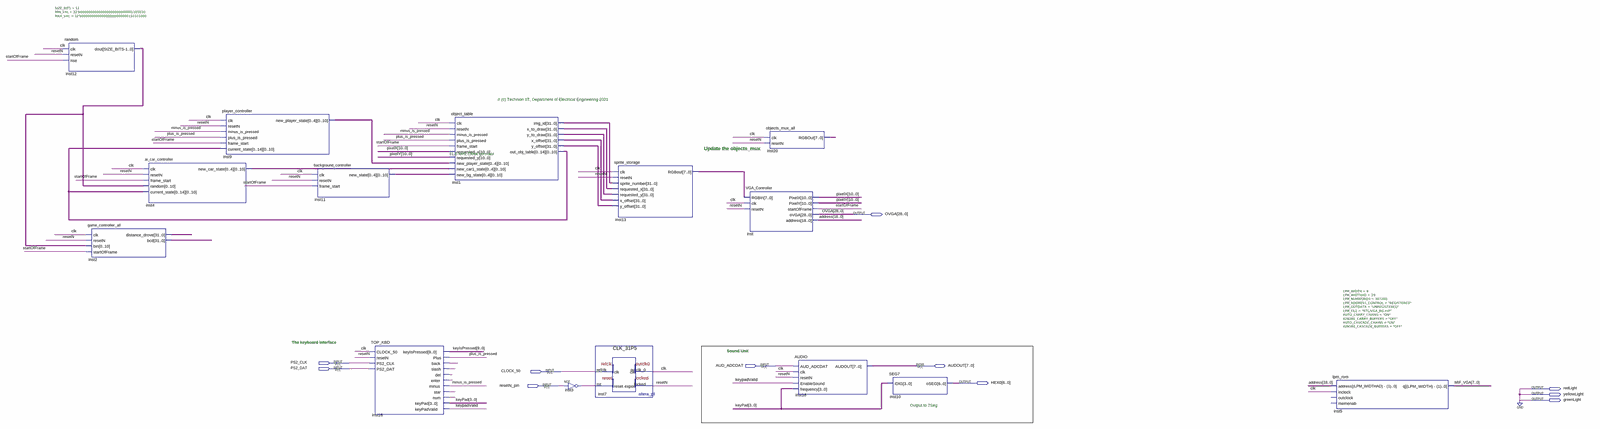
[diagram p0: schematic sheet, whole]
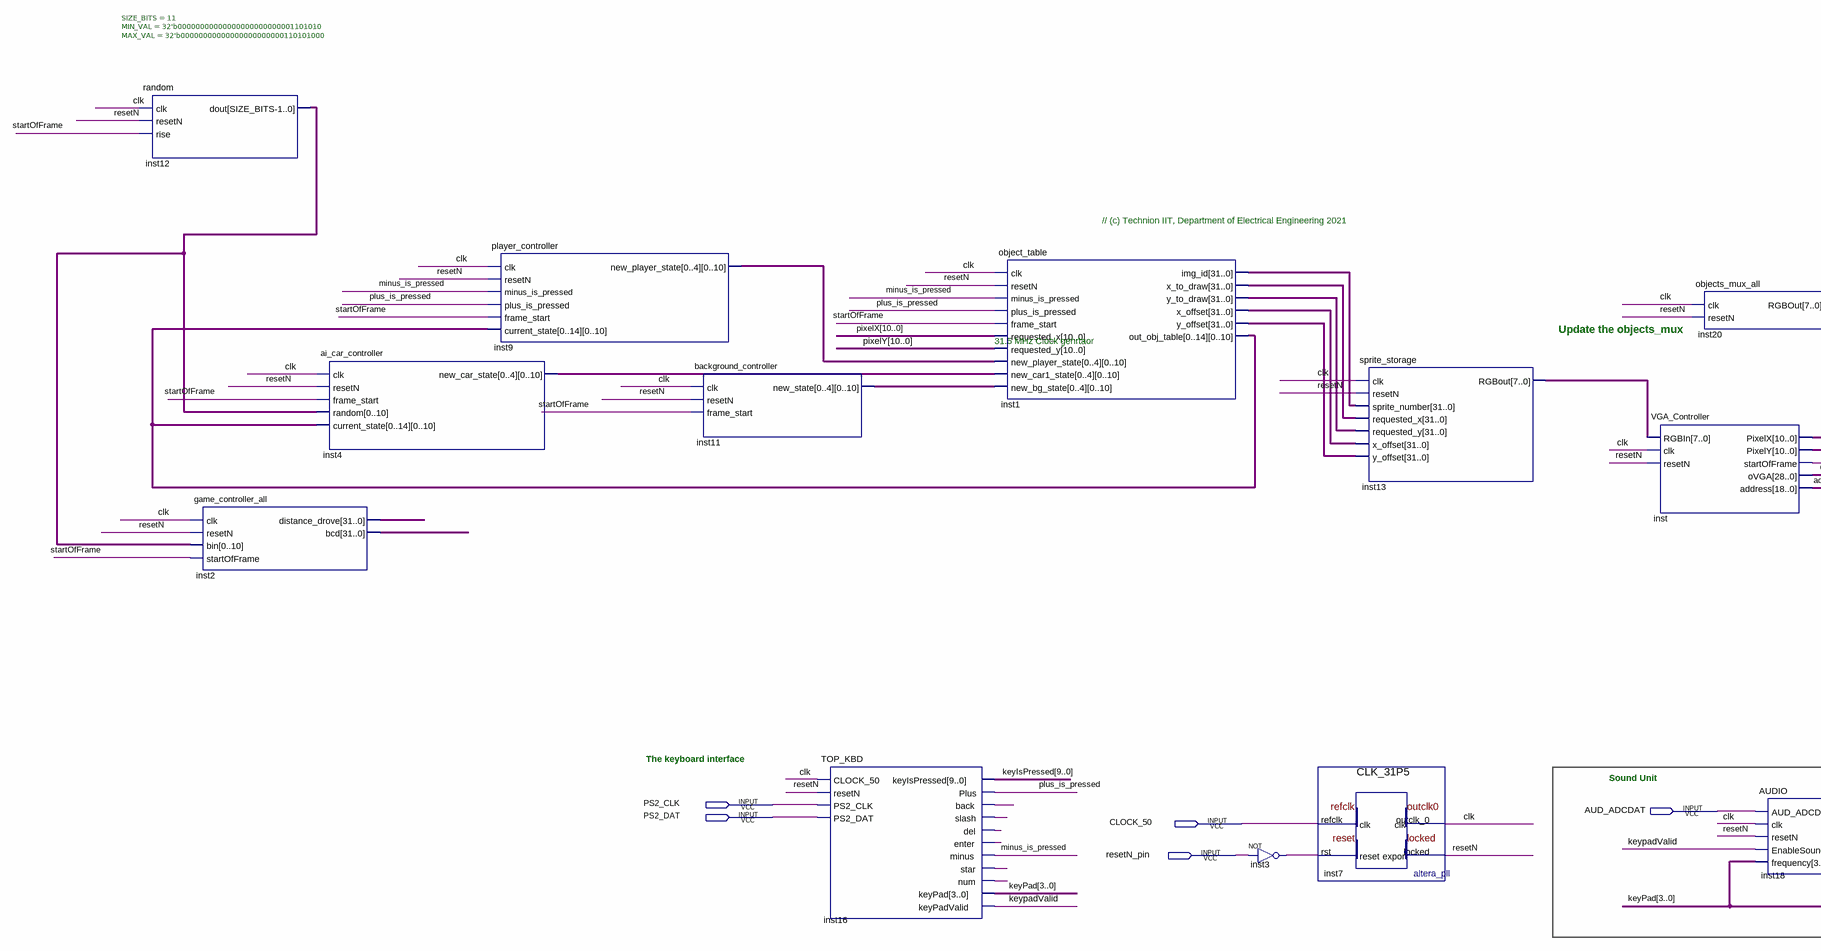
[diagram p1: schematic sheet, left part]
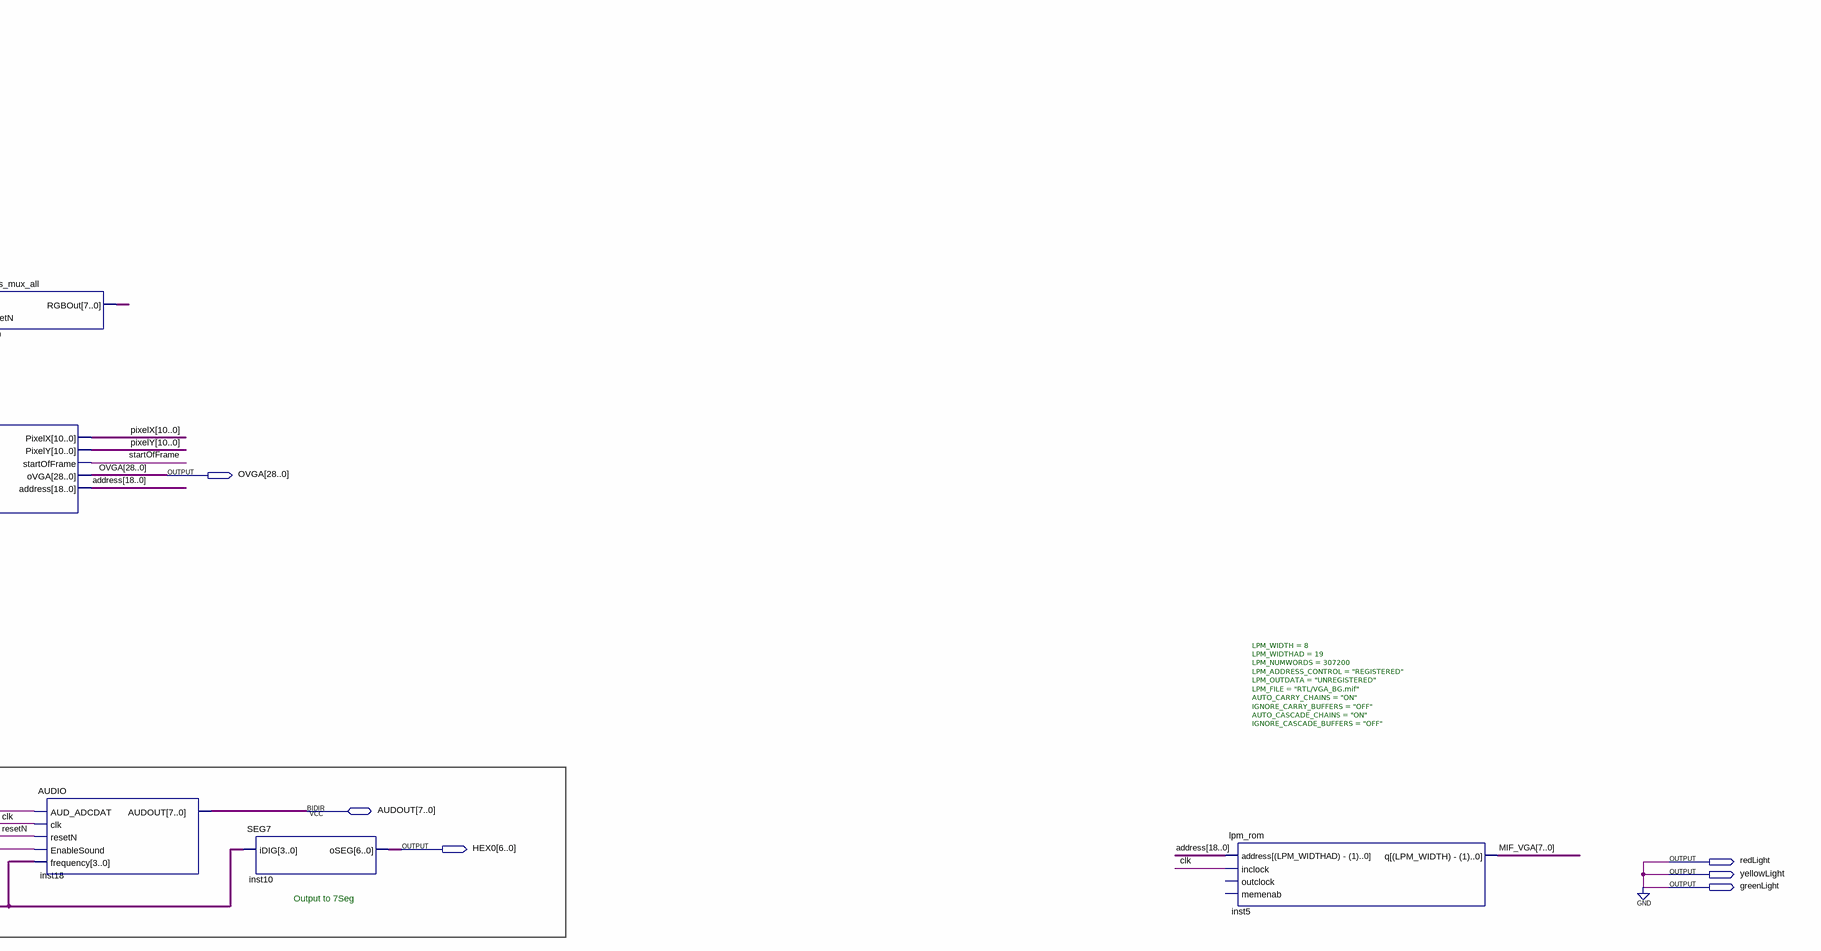
[diagram p2: schematic sheet, right part]
// Quartus schematic TOP_VGA_DEMO_KBD_MOVING_HARTS.bdf as structural Verilog: 15 symbols, 11 pins
module TOP_VGA_DEMO_KBD_MOVING_HARTS (
  input  PS2_CLK,
  input  AUD_ADCDAT,
  input  PS2_DAT,
  input  CLOCK_50,
  input  resetN_pin,
  inout  [7:0] AUDOUT,
  output [28:0] OVGA,
  output [6:0] HEX0,
  output redLight,
  output yellowLight,
  output greenLight
);

  wire clk, inst3_out, inst16_back, inst16_del, inst16_enter, inst16_num, inst16_slash, inst16_star,
       keypadValid, minus_is_pressed, plus_is_pressed, resetN, startOfFrame;
  wire [3:0] keyPad;
  wire [7:0] inst13_rgbout, inst20_rgbout, MIF_VGA;
  wire [9:0] keyIsPressed;
  wire [10:0] inst12_dout, pixelX, pixelY;
  wire [18:0] address;
  wire [31:0] inst1_img_id, inst1_x_offset, inst1_x_to_draw, inst1_y_offset, inst1_y_to_draw, inst2_bcd,
       inst2_distance_drove;
  wire [54:0] inst4_new_car_state, inst9_new_player_state, inst11_new_state;
  wire [164:0] inst1_out_obj_table;

  random #(.SIZE_BITS(11), .MIN_VAL(32'b00000000000000000000000001101010), .MAX_VAL(32'b00000000000000000000000110101000)) inst12 (
    .clk(clk), .resetN(resetN), .rise(startOfFrame), .dout(inst12_dout));
  game_controller_all inst2 (
    .clk(clk), .resetN(resetN), .bin(inst12_dout), .startOfFrame(startOfFrame),
    .distance_drove(inst2_distance_drove), .bcd(inst2_bcd));
  ai_car_controller inst4 (
    .clk(clk), .resetN(resetN), .frame_start(startOfFrame), .random(inst12_dout),
    .current_state(inst1_out_obj_table), .new_car_state(inst4_new_car_state));
  player_controller inst9 (
    .clk(clk), .resetN(resetN), .minus_is_pressed(minus_is_pressed), .plus_is_pressed(plus_is_pressed),
    .frame_start(startOfFrame), .current_state(inst1_out_obj_table), .new_player_state(inst9_new_player_state));
  background_controller inst11 (.clk(clk), .resetN(resetN), .frame_start(startOfFrame), .new_state(inst11_new_state));
  TOP_KBD inst16 (
    .CLOCK_50(clk), .resetN(resetN), .PS2_CLK(PS2_CLK), .PS2_DAT(PS2_DAT), .keyIsPressed(keyIsPressed),
    .Plus(plus_is_pressed), .back(inst16_back), .slash(inst16_slash), .del(inst16_del), .enter(inst16_enter),
    .minus(minus_is_pressed), .star(inst16_star), .num(inst16_num), .keyPad(keyPad), .keyPadValid(keypadValid));
  object_table inst1 (
    .clk(clk), .resetN(resetN), .minus_is_pressed(minus_is_pressed), .plus_is_pressed(plus_is_pressed),
    .frame_start(startOfFrame), .requested_x(pixelX), .requested_y(pixelY),
    .new_player_state(inst9_new_player_state), .new_car1_state(inst4_new_car_state),
    .new_bg_state(inst11_new_state), .img_id(inst1_img_id), .x_to_draw(inst1_x_to_draw),
    .y_to_draw(inst1_y_to_draw), .x_offset(inst1_x_offset), .y_offset(inst1_y_offset),
    .out_obj_table(inst1_out_obj_table));
  not inst3 (inst3_out, resetN_pin);
  CLK_31P5 inst7 (.refclk(CLOCK_50), .rst(inst3_out), .outclk_0(clk), .locked(resetN));
  sprite_storage inst13 (
    .clk(clk), .resetN(resetN), .sprite_number(inst1_img_id), .requested_x(inst1_x_to_draw),
    .requested_y(inst1_y_to_draw), .x_offset(inst1_x_offset), .y_offset(inst1_y_offset),
    .RGBout(inst13_rgbout));
  objects_mux_all inst20 (.clk(clk), .resetN(resetN), .RGBOut(inst20_rgbout));
  VGA_Controller inst (
    .RGBIn(inst13_rgbout), .clk(clk), .resetN(resetN), .PixelX(pixelX), .PixelY(pixelY),
    .startOfFrame(startOfFrame), .oVGA(OVGA), .address(address));
  AUDIO inst18 (
    .AUD_ADCDAT(AUD_ADCDAT), .clk(clk), .resetN(resetN), .EnableSound(keypadValid), .frequency(keyPad),
    .AUDOUT(AUDOUT));
  SEG7 inst10 (.iDIG(keyPad), .oSEG(HEX0));
  lpm_rom #(.LPM_WIDTH(8), .LPM_WIDTHAD(19), .LPM_NUMWORDS(307200), .LPM_ADDRESS_CONTROL("REGISTERED"), .LPM_OUTDATA("UNREGISTERED"), .LPM_FILE("RTL/VGA_BG.mif"), .AUTO_CARRY_CHAINS("ON"), .IGNORE_CARRY_BUFFERS("OFF"), .AUTO_CASCADE_CHAINS("ON"), .IGNORE_CASCADE_BUFFERS("OFF")) inst5 (
    .address(address), .inclock(clk), .q(MIF_VGA));  // open: outclock, memenab

  assign greenLight = 1'b0;
  assign redLight = 1'b0;
  assign yellowLight = 1'b0;

  // Notes on the sheet:
  //   // (c) Technion IIT, Department of Electrical Engineering 2021
  //   Update the objects_mux
  //   31.5 MHz Clock genrtaor
  //   The keyboard interface
  //   Sound Unit
  //   Output to 7Seg
endmodule
